# Altium schematic sheet dc_dc_buck_converter.schdoc: Понижающий
size 420 x 297 mm; Date: 28/10/2018; ApprovedBy: Королев; CheckedBy: Капустин; DrawnBy: Хомутов; Organization: ЦНИИ РТК; DocumentNumber: МК.111802.001 Э3; Revision: Королев; SheetTotal: 1; Title1str: Преобразователь; DocumentType: Схема электрическая принципиальная; Format: A3; ImagePath: Введите номер платы
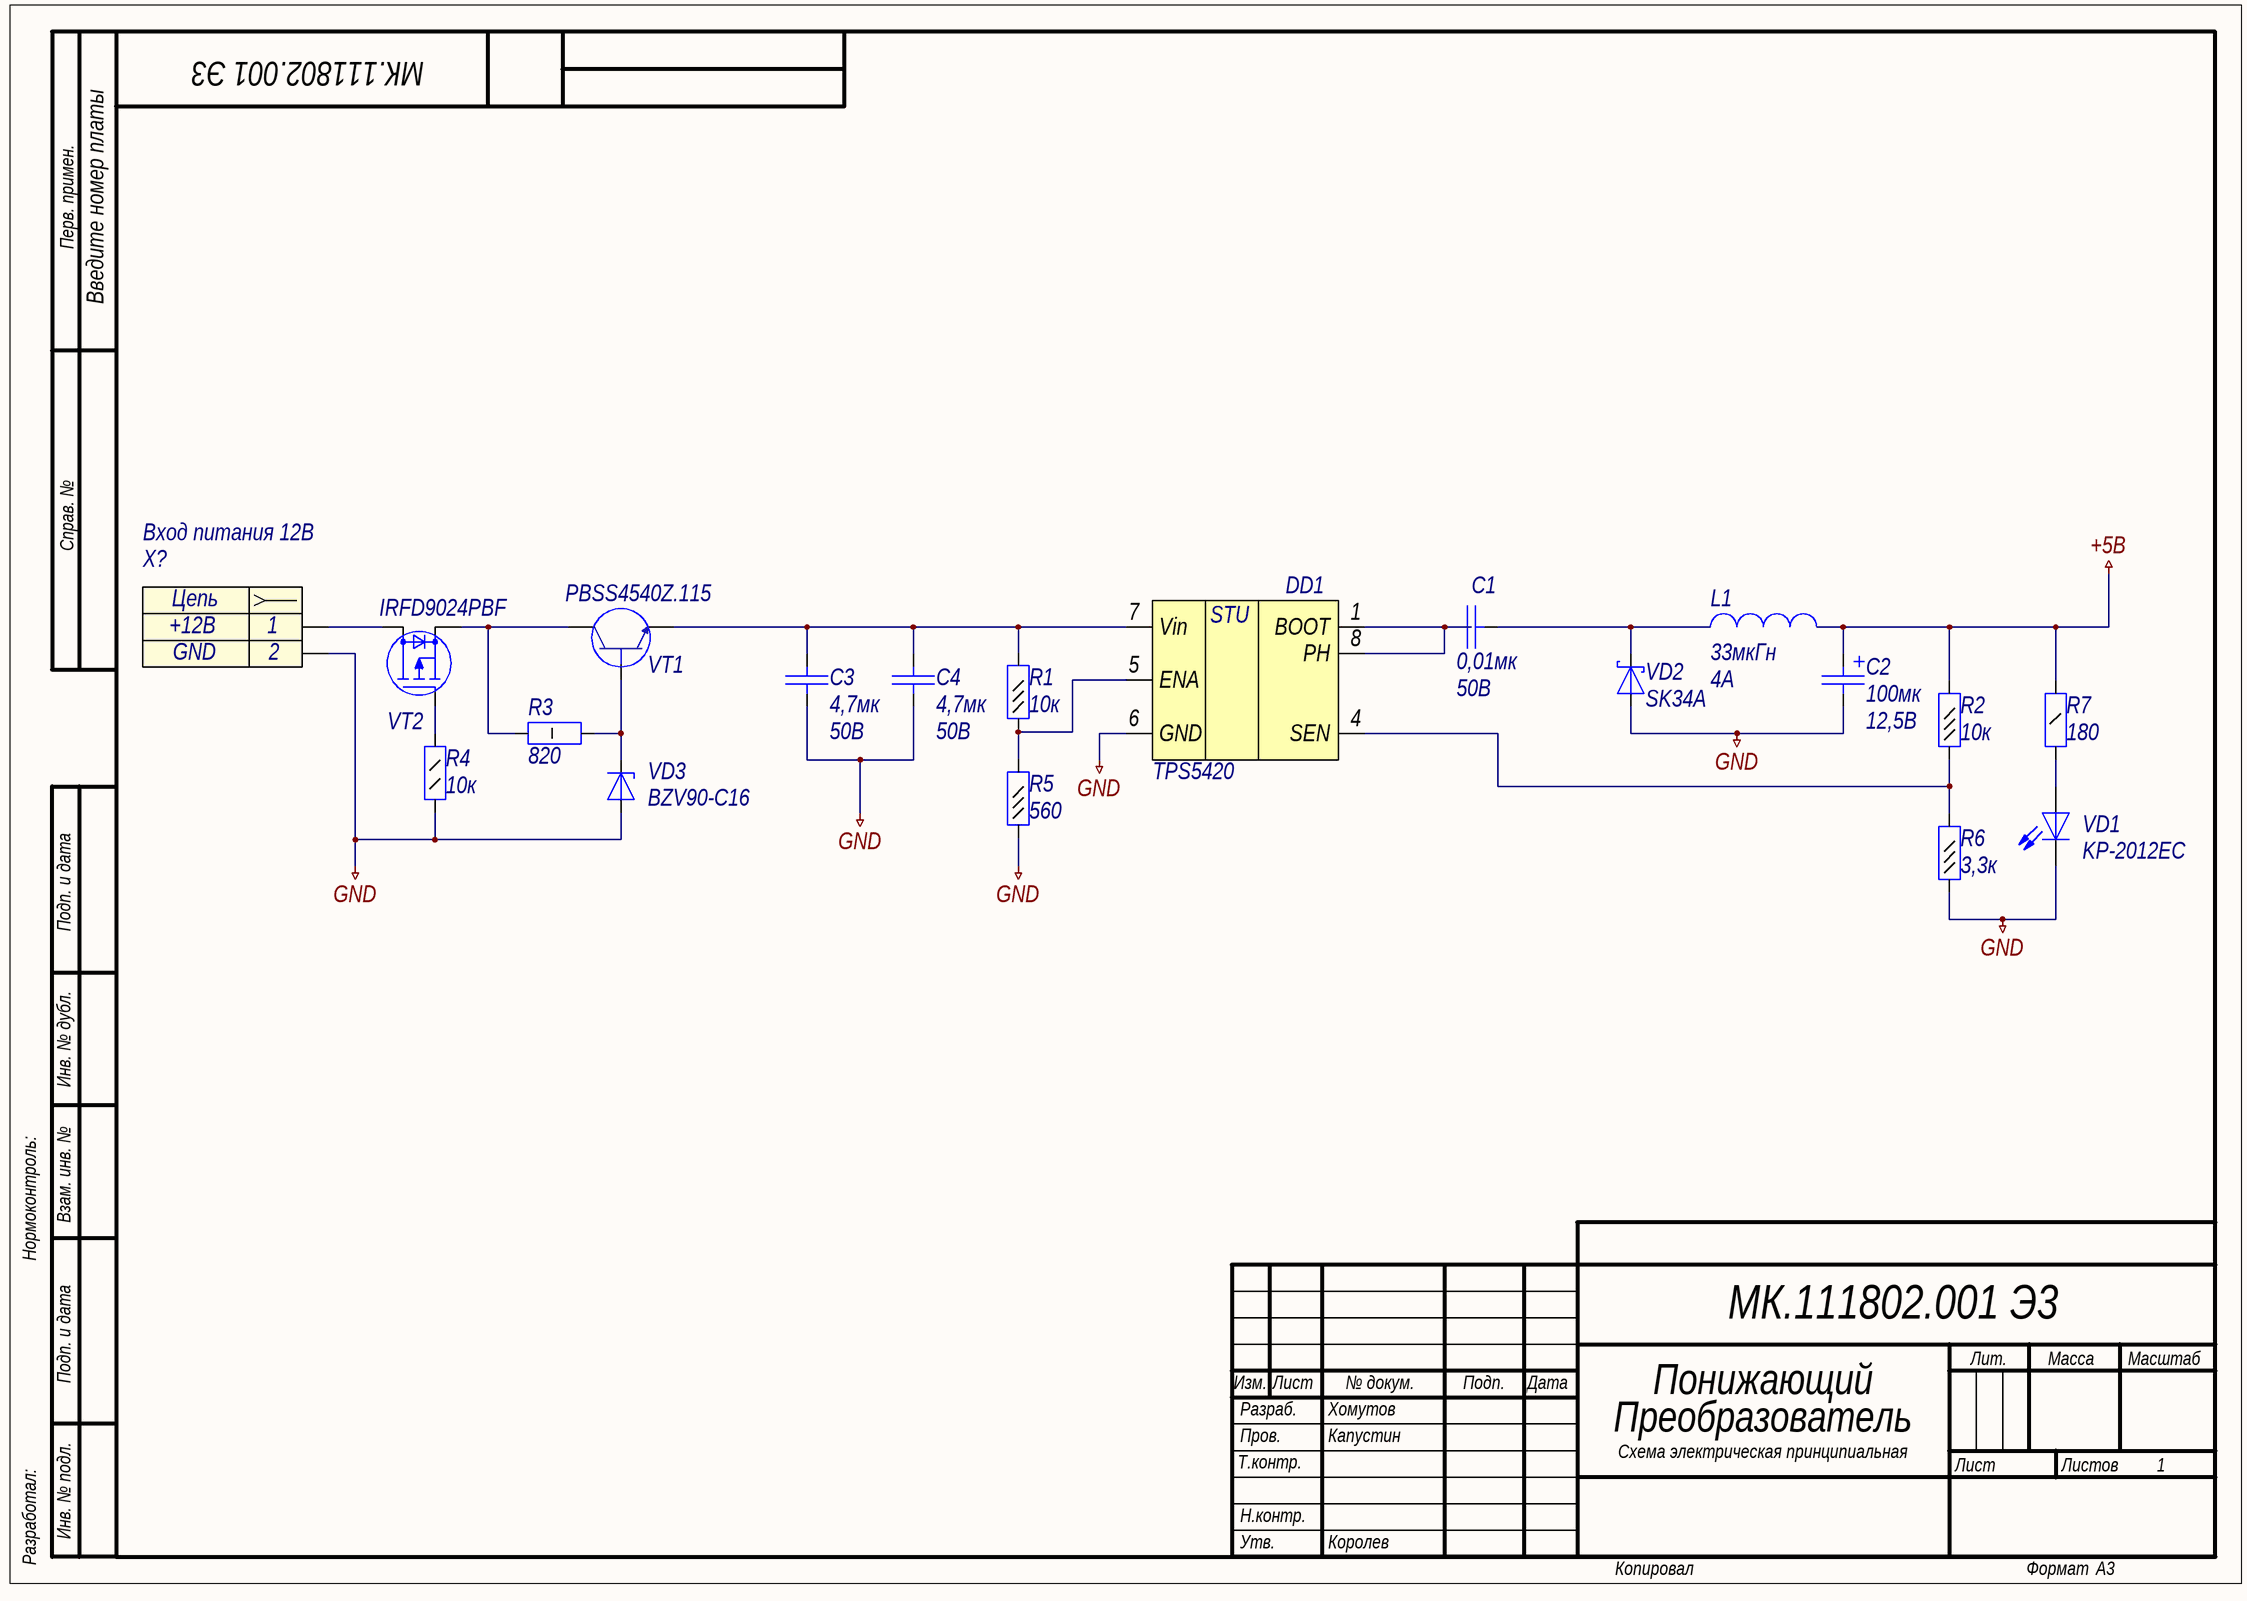
[diagram p0: dc_dc_buck_converter.schdoc]

## Parts
C1  value 0,01мк  Voltage: 50B  [C0402]  (hidden comment: Capacitor)
C2  value 100мк  Voltage: 12,5В  [TANTAL CASE E]  (hidden comment: Capacitor_pol)
C3  value 4,7мк  Voltage: 50В  [C1206]  (hidden comment: Capacitor)
C4  value 4,7мк  Voltage: 50В  [C1206]  (hidden comment: Capacitor)
DD1  TPS5420  [SO8]
L1  value 33мкГн  Rated Current: 4A  [L4040]  (hidden comment: Inductor)
R1  value 10к  [R0402]  (hidden comment: Resistor_0,062Вт)
R2  value 10к  [R0402]  (hidden comment: Resistor_0,062Вт)
R3  value 820  [R2512]  (hidden comment: Resistor_1Вт)
R4  value 10к  [R0805]  (hidden comment: Resistor_0,125Вт)
R5  value 560  [R0402]  (hidden comment: Resistor_0,062Вт)
R6  value 3,3к  [R0402]  (hidden comment: Resistor_0,062Вт)
R7  value 180  [R1206]  (hidden comment: Resistor_0,25Вт)
VD1  Part Number: KP-2012EC  [L_0805]  (hidden comment: LED)
VD2  Part Number: SK34A  [SMA]  (hidden comment: DiodeSchottky)
VD3  Part Number: BZV90-C16  [SOT-223]  (hidden comment: DiodeZener)
VT1  Part Number: PBSS4540Z.115  [SOT-223]  (hidden comment: BJT NPN)
VT2  Part Number: IRFD9024PBF  [HD-1]  (hidden comment: P-MOSFET)
X?  Вход питания 12В  [DS-210]

## Nets
+5В: C2.1 L1.2 R2.2 R7.2
GND: C2.2 C3.1 C4.1 DD1.6(GND) R4.1 R5.1 R6.1 VD1.1(K) VD2.2(A) VD3.2(A) X?.2
NetC1_1: C1.1 L1.1 VD2.1(K)
NetC1_2: C1.2 DD1.1(BOOT) DD1.8(PH)
NetC3_2: C3.2 C4.2 DD1.7(Vin) R1.2 VT1.2
NetDD1_4: DD1.4(SEN) R2.1 R6.2
NetDD1_5: DD1.5(ENA) R1.1 R5.2
NetR3_1: R3.1 VD3.1(K) VT1.1
NetR3_2: R3.2 VT1.3 VT2.2(S)
NetR4_2: R4.2 VT2.1(G)
NetR7_1: R7.1 VD1.2(A)
NetVT2_3: VT2.3(D) X?.1

## Notes on the sheet
- Перв. примен.
- Справ. №
- Подп. и дата
- Инв. № дубл.
- Нормоконтроль:
- Взам. инв. №
- Изм.
- Лист
- № докум.
- Подп.
- Дата
- Лит.
- Масса
- Масштаб
- Т.контр.
- Пров.
- Разраб.
- Листов
- Разработал:
- Инв. № подл.
- Н.контр.
- Утв.
- Копировал
- Формат
- (in symbol connect1) Цепь
- (in symbol pwr13) STU

## Library data of the parts
C1 = cap42: Конденсатор; Part Name: Ceramic; Manufacture: Murata; Part Number: GRM155R71H103K; id: cap42; TKE: X7R
C2 = cap197: Конденсатор полярный; Part Name: Polimer; Manufacture: Murata; Part Number: ECASD91B107M012K00; id: cap197; TKE: 12mOhm
C3 C4 = cap189: Конденсатор; Part Name: Ceramic; Manufacture: Murata; Part Number: GRM31CR71H475KA12L; id: cap189; TKE: X7R
DD1 = pwr13: 2-A, WIDE INPUT RANGE, STEP-DOWN CONVERTER; Manufacturer: Texas Instruments; id: pwr13; Input Voltage: 5,5 - 36B; Output Voltage: Adj; Current: 2A; Part Name: Step-Down Converter; Type: Impulse; Part Number: TPS5420
L1 = ind8: EMI Suppression Filter; Part Number: IHLP4040DZER330M11; Manufacture: Vishay; id: ind8; Resistance: 94,5mOhm; Part Name: Inductor
R1 R2 = res290: Резистор; Manufacture: Yageo; Part Number: RC0402FR-0710KL; id: res290; Accuracy: 1%; Part Name: Resistor; Power: 0,062Вт
R3 = res843: Резистор; Manufacture: Yageo; Part Number: RC2512FR-07820RL; id: res843; Accuracy: 1%; Power: 1Вт; Part Name: Resistor
R4 = res121: Резистор; Manufacture: Yageo; Part Number: RC0805FR-07100KL; id: res121; Accuracy: 1%; Part Name: Resistor; Power: 0,125Вт
R5 = res260: Резистор; Manufacture: Yageo; Part Number: RC0402FR-07560RL; id: res260; Accuracy: 1%; Part Name: Resistor; Power: 0,062Вт
R6 = res278: Резистор; Manufacture: Yageo; Part Number: RC0402FR-072K3; id: res278; Accuracy: 1%; Part Name: Resistor; Power: 0,062Вт
R7 = res634: Резистор; Manufacture: Yageo; Part Number: RC1206FR-07180RL; id: res634; Accuracy: 1%; Power: 0,25Вт; Part Name: Resistor
VD1 = diode8: Светодиод; id: diode8; Part Name: LED
VD2 = diode2: Диод Шоттки; Manufacture: Taiwan Semiconductor; id: diode2; Max Reverse Voltage: 40B; Forward Voltage: 0,55B; Forward Current: 3A; Part Name: Diode Schottky
VD3 = diode19: Стабилитрон; Manufacture: Nexperia; Max Reverse Voltage: 17,1B; Forward Voltage: 0,6B; Forward Current: 50mA; Breakdown Voltage: 16В; Breakdown Current: 5mA; Capacitance: 75pF; Number of Channels: 1; id: diode19; Part Name: Diode Zener
VT1 = bjt3: Part Name: Transistor; id: bjt3; hfe: 300; Vceo max: 40В; Ic max: 5А; Power: 2Вт; Frequency: 130МГц; Structure: npn
VT2 = trans1: N-MOSFET; Part Name: Transistor; Manufacturer: Vishay; id: trans1; Structure: p-channel; V drain-source max: (-60B); Rds: 0,28Ohm; Gate-to-source voltage: (+-)20B; Continuous drain current: 2,5A; Pulsed drain current: 20A; Power dissipation: 1,3W
X? = connect1: Разъем - 2 конт. розетка; Part Name: DC Power Jack; Part Number: DS-210B(PBT)(NB); Contact_1: +12В; Contact_2: GND; id: connect1